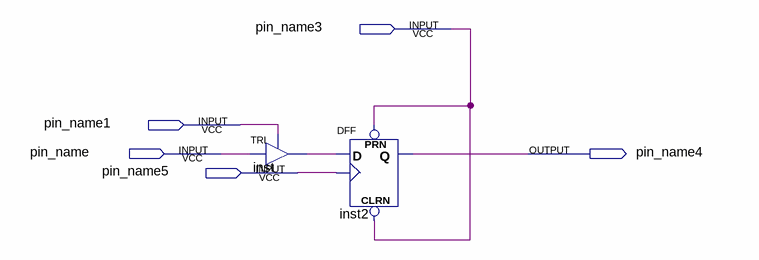
[diagram p0: schematic sheet]
// Quartus schematic test.bdf as structural Verilog: 2 symbols, 5 pins
module test (
  input  pin_name3,
  input  pin_name1,
  input  pin_name,
  input  pin_name5,
  output pin_name4
);

  wire inst_out;

  TRI inst (.IN(pin_name), .OE(pin_name1), .OUT(inst_out));
  DFF inst2 (.CLRN(pin_name3), .CLK(pin_name5), .D(inst_out), .PRN(pin_name3), .Q(pin_name4));
endmodule
